# Altium schematic sheet OV7670_headers.SchDoc: 0V7670 header connections and voltage conversion
size A4; Date: 2022-01-17; Author: Juan del Pino Mena; CompanyName: TCI; Engineer: Juan del Pino Mena; Organization: UGR; Revision: 0.8; SheetNumber: 3; SheetTotal: 3
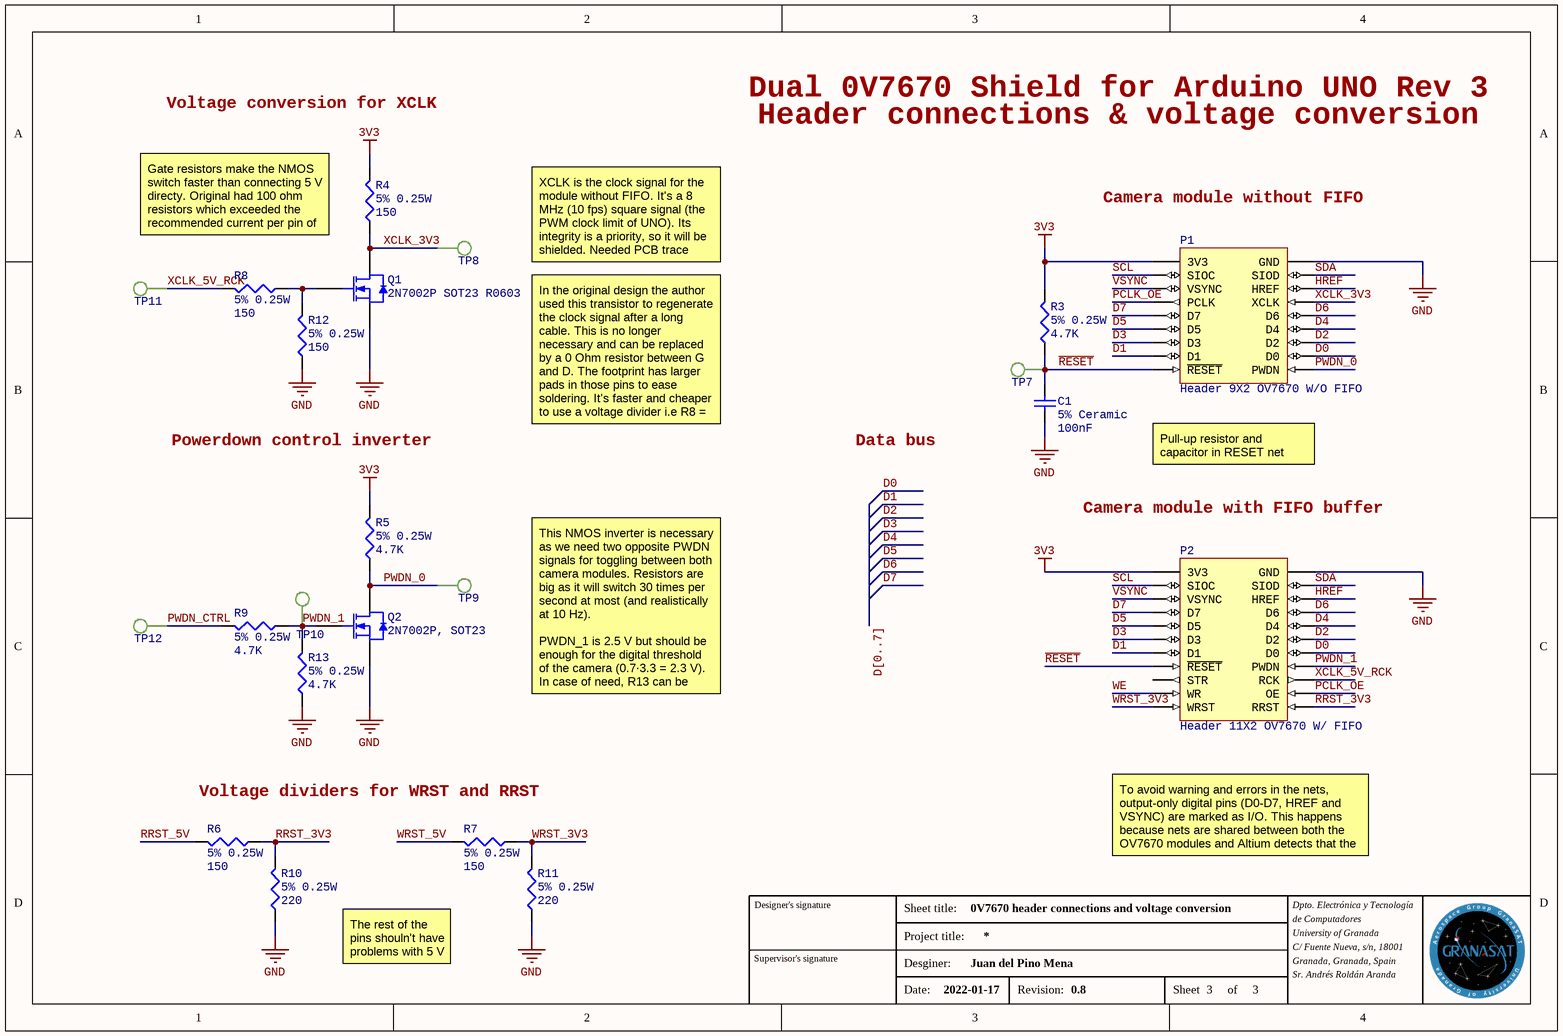
[diagram p0: OV7670_headers.SchDoc]

## Parts
C1  5% Ceramic  value 100nF  [0805 CAP]
P1  Header 9X2 OV7670 W/O FIFO  [9x2 PIN HEADER]
P2  Header 11X2 OV7670 W/ FIFO  [11x2 PIN HEADER]
Q1  2N7002P SOT23 R0603  [2N7002P SOT23 WITH LARGE G,D PADS]
Q2  2N7002P, SOT23  [2N7002P SOT23]
R3  5% 0.25W  value 4.7K  [0603 RES]
R4  5% 0.25W  value 150  [0603 RES]
R5  5% 0.25W  value 4.7K  [0603 RES]
R6  5% 0.25W  value 150  [0603 RES]
R7  5% 0.25W  value 150  [0603 RES]
R8  5% 0.25W  value 150  [0603 RES]
R9  5% 0.25W  value 4.7K  [0603 RES]
R10  5% 0.25W  value 220  [0603 RES]
R11  5% 0.25W  value 220  [0603 RES]
R12  5% 0.25W  value 150  [0603 RES]
R13  5% 0.25W  value 4.7K  [0603 RES]
TP7  Test Point Pad  [TEST POINT PAD]  (value not drawn)
TP8  Test Point Pad  [TEST POINT PAD]  (value not drawn)
TP9  Test Point Pad  [TEST POINT PAD]  (value not drawn)
TP10  Test Point Pad  [TEST POINT PAD]  (value not drawn)
TP11  Test Point Pad  [TEST POINT PAD]  (value not drawn)
TP12  Test Point Pad  [TEST POINT PAD]  (value not drawn)

## Nets
3V3: P1.1(3V3) P2.1(3V3) R3.2 R4.2 R5.2
GND: C1.1 P1.2(GND) P2.2(GND) Q1.3(S) Q2.3(S) R10.1 R11.1 R12.1 R13.1
D0: P1.16(D0) P2.14(D0)
D1: P1.15(D1) P2.13(D1)
D2: P1.14(D2) P2.12(D2)
D3: P1.13(D3) P2.11(D3)
D4: P1.12(D4) P2.10(D4)
D5: P1.11(D5) P2.9(D5)
D6: P1.10(D6) P2.8(D6)
D7: P1.9(D7) P2.7(D7)
HREF: P1.6(HREF) P2.6(HREF)
PCLK_OE: P1.7(PCLK) P2.20(OE)
PWDN_0: P1.18(PWDN) Q2.2(D) R5.1 TP9.1
PWDN_1: P2.16(PWDN) Q2.1(G) R9.1 R13.2 TP10.1
PWDN_CTRL: R9.2 TP12.1
~{RESET}: C1.2 P1.17(~{RESET}) P2.15(~{RESET}) R3.1 TP7.1
RRST_3V3: P2.22(RRST) R6.1 R10.2
RRST_5V: R6.2
SCL: P1.3(SIOC) P2.3(SIOC)
SDA: P1.4(SIOD) P2.4(SIOD)
VSYNC: P1.5(VSYNC) P2.5(VSYNC)
WE: P2.19(WR)
WRST_3V3: P2.21(WRST) R7.1 R11.2
WRST_5V: R7.2
XCLK_3V3: P1.8(XCLK) Q1.2(D) R4.1 TP8.1
XCLK_5V_RCK: P2.18(RCK) R8.2 TP11.1
NetQ1_1: Q1.1(G) R8.1 R12.2

Not connected (* = marked no-connect by the designer): P2 17(STR)

## Buses and harness runs
bus D[0..7]

## Notes on the sheet
- Voltage conversion for XCLK
- Dual 0V7670 Shield for Arduino UNO Rev 3
- Header connections & voltage conversion
- Gate resistors make the NMOS switch faster than connecting 5 V directy. Original had 100 ohm resistors which exceeded the recommended current per pin of 20 mA.
- Camera module without FIFO
- XCLK is the clock signal for the module without FIFO. It's a 8 MHz (10 fps) square signal (the PWM clock limit of UNO). Its integrity is a priority, so it will be shielded. Needed PCB trace bandwidth is over 40 MHz.
- Powerdown control inverter
- In the original design the author used this transistor to regenerate the clock signal after a long cable. This is no longer necessary and can be replaced by a 0 Ohm resistor between G and D. The footprint has larger pads in those pins to ease soldering. It's faster and cheaper to use a voltage divider i.e R8 = 150 Ohm and R12 = 220 Ohm (from 5 V to 3 V)
- Data bus
- Pull-up resistor and capacitor in RESET net  stabilizes voltage
- Camera module with FIFO buffer
- This NMOS inverter is necessary as we need two opposite PWDN signals for toggling between both camera modules. Resistors are big as it will switch 30 times per second at most (and realistically at 10 Hz).
  PWDN_1 is 2.5 V but should be enough for the digital threshold of the camera (0.7·3.3 = 2.3 V). In case of need, R13 can be changed by a 6.8 kOhm one.
- Voltage dividers for WRST and RRST
- To avoid warning and errors in the nets, output-only digital pins (D0-D7, HREF and VSYNC) are marked as I/O. This happens because nets are shared between both the OV7670 modules and Altium detects that the same net has 2 output ports.
- The rest of the pins shouln't have problems with 5 V
- Designer's signature
- Sheet title:
- Dpto. Electrónica y Tecnología
- de Computadores
- Supervisor's signature
- Project title:
- Desginer:
- University of Granada
- C/ Fuente Nueva, s/n, 18001
- Granada, Granada, Spain
- Sr. Andrés Roldán Aranda
- Date:
- Revision:
- Sheet
- of

## Library data of the parts
C1 = Cap100nF: SMD Ceramic Capacitor 100nF 5% 0805; Published: 8-Jun-2000; LatestRevisionDate: 17-Jul-2002; LatestRevisionNote: Re-released for DXP Platform.; PackageReference: RAD-0.3; Publisher: Altium Limited; PackageDescription: Radial Cap, Thru-Hole; 2 Leads; 0.3 in Pin Spacing
P1 = Header 9X2 OV7670 W/O FIFO: Header, 9-Pin, Dual row. Pinout of OV7670 module without FIFO buffer.; Publisher: Altium Limited
P2 = Header 11X2 OV7670 W/ FIFO: Header, 11-Pin, Dual row. Pinout of OV7670 module with FIFO buffer.; LatestRevisionDate: 17-Jul-2002; LatestRevisionNote: Re-released for DXP Platform.; Publisher: Altium Limited
Q1 = 2N7002P (0Ohm): N-Channel MOSFET 2N7002P SOT23 / version with footprint compatible with 0 Ohm 0603 resistor; Note: Pin 2 is electrically connected to pin 4.; Published: 8-Jun-2000; LatestRevisionDate: 17-Jul-2002; LatestRevisionNote: Re-released for DXP Platform.; DatasheetVersion: PD-9.814; PackageVersion: Feb-1997; PackageReference: TO-220AB; Publisher: Altium Limited; PackageDescription: TO, Thru-Hole, Vertical, Heatsink Mounted; 3 In-Line Leads; Pitch 2.54 mm; ComponentLink1Description: Manufacturer Link; ComponentLink1URL: http://www.irf.com/
Q2 = 2N7002P: N-Channel MOSFET 2N7002P SOT23; Note: Pin 2 is electrically connected to pin 4.; Published: 8-Jun-2000; LatestRevisionDate: 17-Jul-2002; LatestRevisionNote: Re-released for DXP Platform.; DatasheetVersion: PD-9.814; PackageVersion: Feb-1997; PackageReference: TO-220AB; Publisher: Altium Limited; PackageDescription: TO, Thru-Hole, Vertical, Heatsink Mounted; 3 In-Line Leads; Pitch 2.54 mm; ComponentLink1Description: Manufacturer Link; ComponentLink1URL: http://www.irf.com/
R3 R5 R9 R13 = Res4K7: SMD Resistor 4.7 KOhm 5% 0.1W 0603; Published: 8-Jun-2000; LatestRevisionDate: 29-May-2009; LatestRevisionNote: IPC-7351 Footprint Added.; PackageReference: J1-0603; Publisher: Altium Limited; PackageDescription: Chip Resistor
R4 R6-R8 R12 = Res150R: SMD Resistor 150 Ohm 5% 0.25W 0603; Published: 8-Jun-2000; LatestRevisionDate: 29-May-2009; LatestRevisionNote: IPC-7351 Footprint Added.; PackageReference: J1-0603; Publisher: Altium Limited; PackageDescription: Chip Resistor
R10 R11 = Res220R: SMD Resistor 220 Ohm 5% 0.25W 0603; Published: 8-Jun-2000; LatestRevisionDate: 29-May-2009; LatestRevisionNote: IPC-7351 Footprint Added.; PackageReference: J1-0603; Publisher: Altium Limited; PackageDescription: Chip Resistor
TP7-TP12 = Test Point Pad: Test point - PCB Pad type.